# Altium project Comma Open 2024 MainBoard.PrjPcb
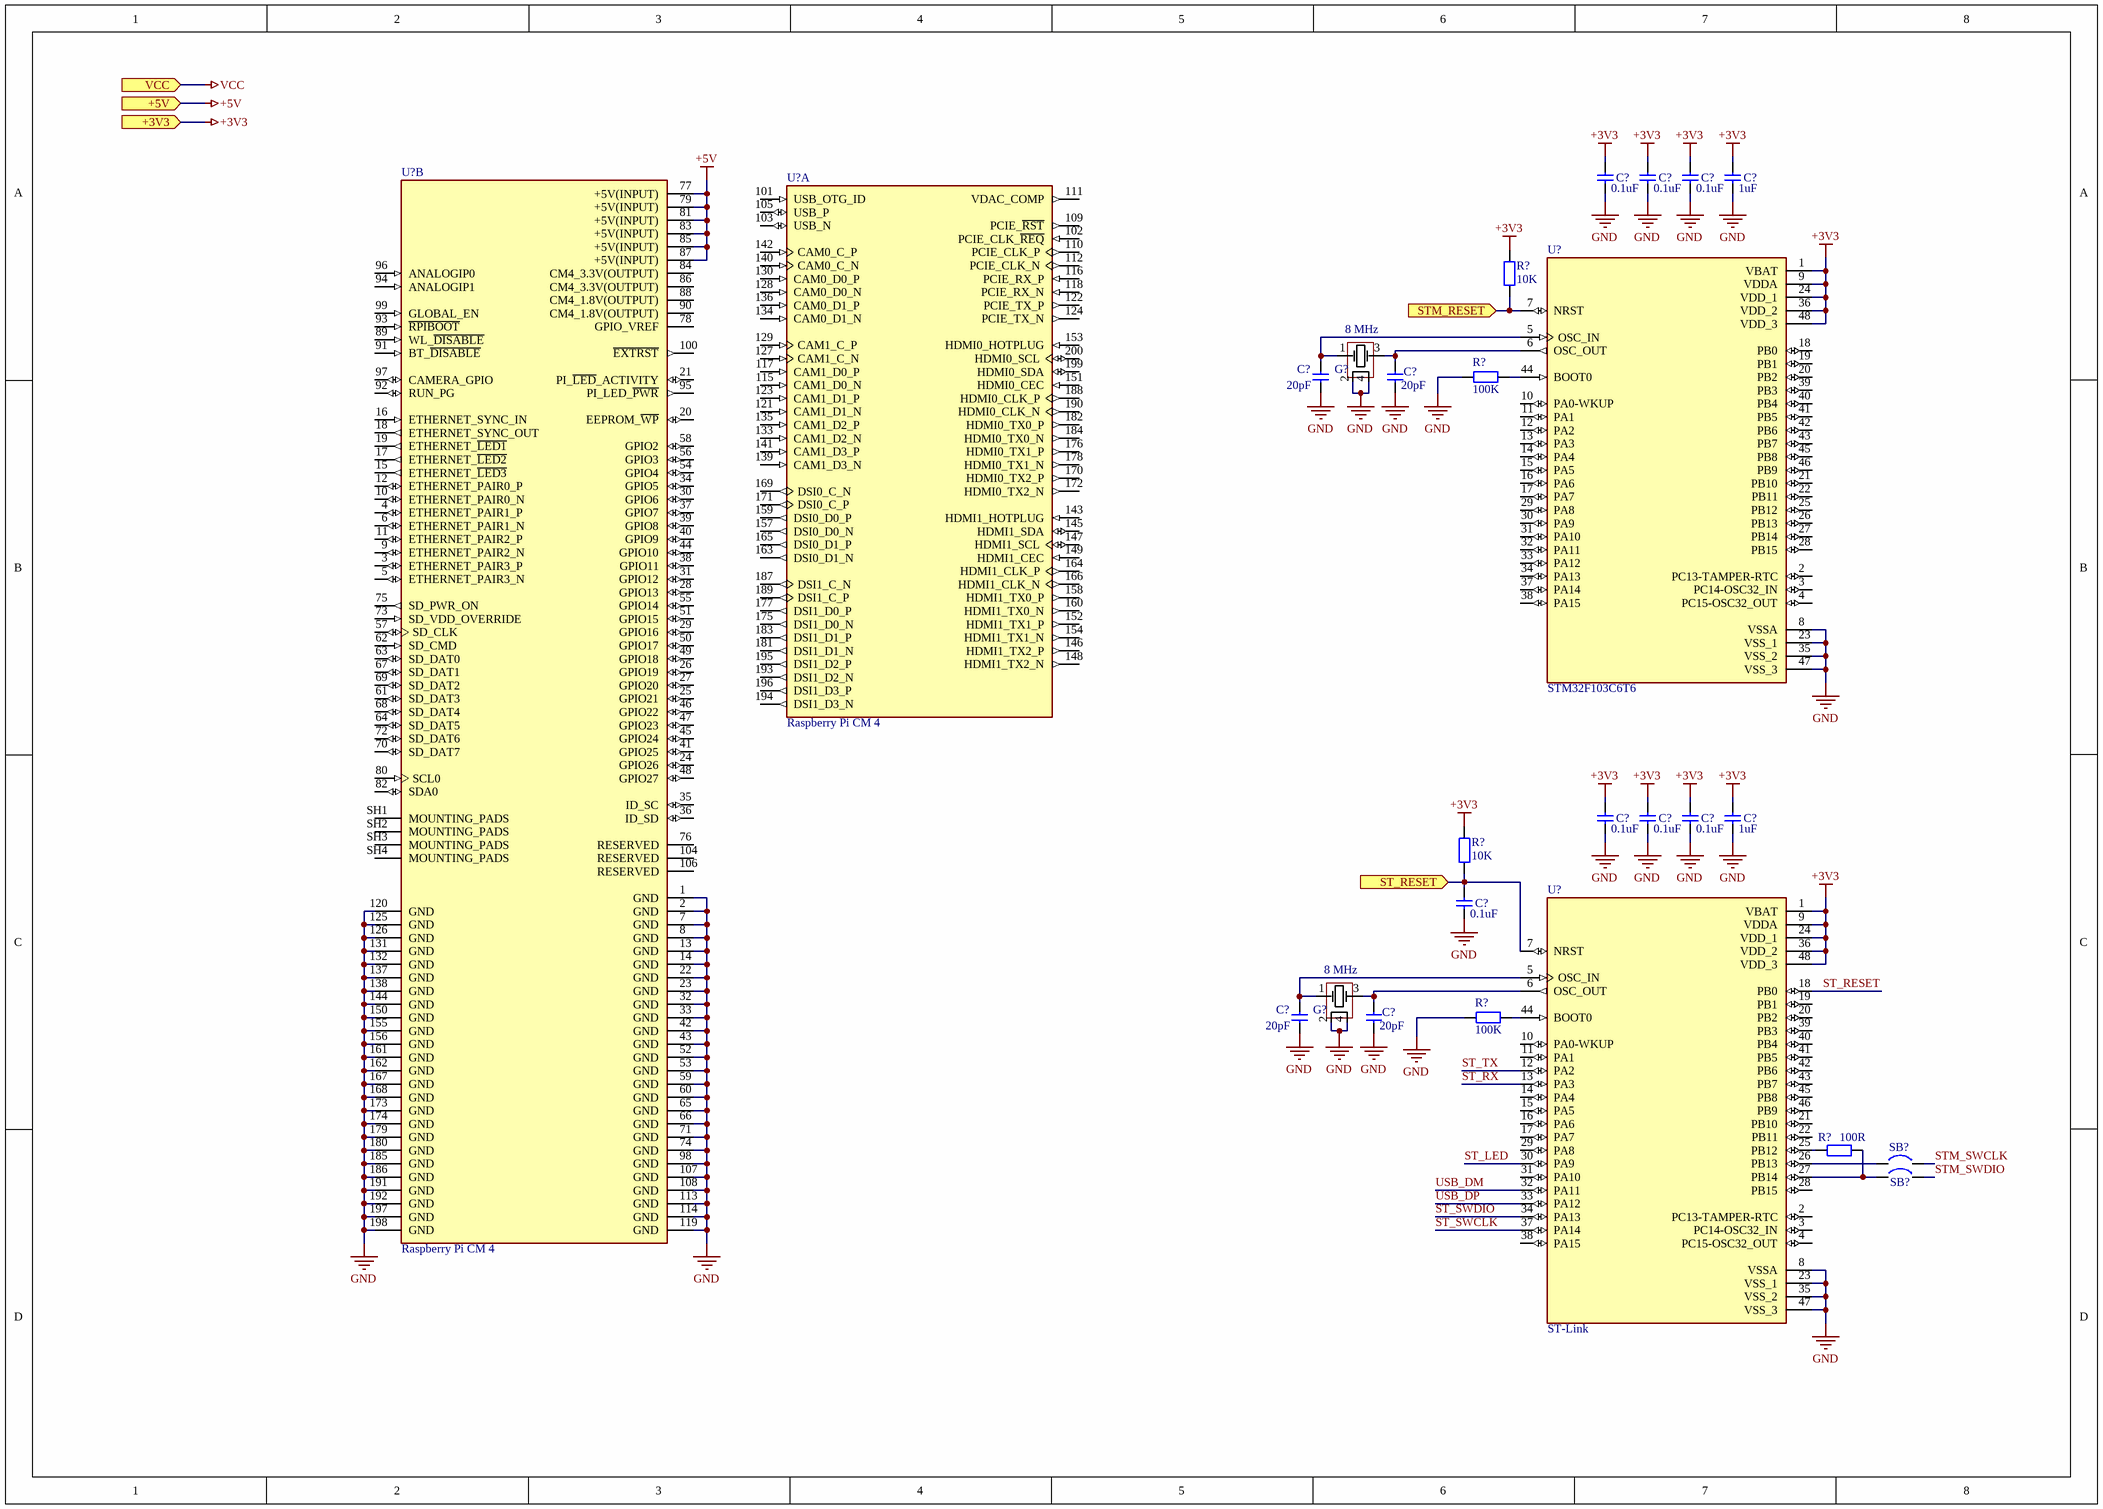
[diagram p0: MainBoard.SchDoc]
2 sheets, 39 parts. Net scope: flat (ports and power ports of the same name join across sheets).
Sheets:
  MainBoard.SchDoc
  Bluetooth.SchDoc

## Sheet MainBoard.SchDoc
size A3; SheetNumber: 1; SheetTotal: 1

### Parts
(Parts that share a designator on the sheet are numbered #1, #2 ... from top to bottom, then left to right.)
C?#1  0.1uF  [CAP0805]
C?#2  0.1uF  [CAP0805]
C?#3  0.1uF  [CAP0805]
C?#4  1uF  [CAP0805]
C?#5  20pF  [CAP0805]
C?#6  20pF  [CAP0805]
C?#7  0.1uF  [CAP0805]
C?#8  0.1uF  [CAP0805]
C?#9  0.1uF  [CAP0805]
C?#10  1uF  [CAP0805]
C?#11  0.1uF  [CAP0805]
C?#12  20pF  [CAP0805]
C?#13  20pF  [CAP0805]
G?#1  8 MHz
G?#2  8 MHz
R?#1  10K  [RES0805]
R?#2  100K  [RES0805]
R?#3  10K  [RES0805]
R?#4  100K  [RES0805]
R?#5  100R  [RES0805]
SB?#1  Solder Bridge  (value not drawn)
SB?#2  Solder Bridge  (value not drawn)
U?#1  Raspberry Pi CM 4  [Raspberry Pi CM 4]  (part A of 2)
U?#2  STM32F103C6T6  [LQFP-48]
U?#3  Raspberry Pi CM 4  [Raspberry Pi CM 4]  (part B of 2)
U?#4  ST-Link  [LQFP-48]

### Ports
+3V3 (in), +5V (in), ST_RESET (in), STM_RESET (in), VCC (in)

### Nets
+3V3: C?#1.2 C?#2.2 C?#3.2 C?#4.2 C?#7.2 C?#8.2 C?#9.2 C?#10.2 R?#1.2 R?#3.2 U?#2.1(VBAT) U?#2.9(VDDA) U?#2.24(VDD_1) U?#2.36(VDD_2) U?#2.48(VDD_3) U?#4.1(VBAT) U?#4.9(VDDA) U?#4.24(VDD_1) U?#4.36(VDD_2) U?#4.48(VDD_3) ; port +3V3
+5V: U?#3.77(+5V(INPUT)) U?#3.79(+5V(INPUT)) U?#3.81(+5V(INPUT)) U?#3.83(+5V(INPUT)) U?#3.85(+5V(INPUT)) U?#3.87(+5V(INPUT)) ; port +5V
GND: C?#1.1 C?#2.1 C?#3.1 C?#4.1 C?#5.1 C?#6.1 C?#7.1 C?#8.1 C?#9.1 C?#10.1 C?#11.1 C?#12.1 C?#13.1 G?#1.2 G?#1.4 G?#2.2 G?#2.4 R?#2.2 R?#4.2 U?#2.8(VSSA) U?#2.23(VSS_1) U?#2.35(VSS_2) U?#2.47(VSS_3) U?#3.1(GND) U?#3.2(GND) U?#3.7(GND) U?#3.8(GND) U?#3.13(GND) U?#3.14(GND) U?#3.22(GND) U?#3.23(GND) U?#3.32(GND) U?#3.33(GND) U?#3.42(GND) U?#3.43(GND) U?#3.52(GND) U?#3.53(GND) U?#3.59(GND) U?#3.60(GND) U?#3.65(GND) U?#3.66(GND) U?#3.71(GND) U?#3.74(GND) U?#3.98(GND) U?#3.107(GND) U?#3.108(GND) U?#3.113(GND) U?#3.114(GND) U?#3.119(GND) U?#3.120(GND) U?#3.125(GND) U?#3.126(GND) U?#3.131(GND) U?#3.132(GND) U?#3.137(GND) U?#3.138(GND) U?#3.144(GND) U?#3.150(GND) U?#3.155(GND) U?#3.156(GND) U?#3.161(GND) U?#3.162(GND) U?#3.167(GND) U?#3.168(GND) U?#3.173(GND) U?#3.174(GND) U?#3.179(GND) U?#3.180(GND) U?#3.185(GND) U?#3.186(GND) U?#3.191(GND) U?#3.192(GND) U?#3.197(GND) U?#3.198(GND) U?#4.8(VSSA) U?#4.23(VSS_1) U?#4.35(VSS_2) U?#4.47(VSS_3)
VCC: port VCC
ST_LED: U?#4.30(PA9)
ST_RESET: U?#4.18(PB0)
ST_RX: U?#4.13(PA3)
ST_SWCLK: U?#4.37(PA14)
ST_SWDIO: U?#4.34(PA13)
ST_TX: U?#4.12(PA2)
STM_SWCLK: SB?#1.2
STM_SWDIO: SB?#2.2
USB_DM: U?#4.32(PA11)
USB_DP: U?#4.33(PA12)
NetC?#5_2: C?#5.2 G?#1.1 U?#2.5(OSC_IN)
NetC?#6_2: C?#6.2 G?#1.3 U?#2.6(OSC_OUT)
NetC?#11_2: C?#11.2 R?#3.1 U?#4.7(NRST) ; port ST_RESET
NetC?#12_2: C?#12.2 G?#2.1 U?#4.5(OSC_IN)
NetC?#13_2: C?#13.2 G?#2.3 U?#4.6(OSC_OUT)
NetR?#1_1: R?#1.1 U?#2.7(NRST) ; port STM_RESET
NetR?#2_1: R?#2.1 U?#2.44(BOOT0)
NetR?#4_1: R?#4.1 U?#4.44(BOOT0)
NetR?#5_1: R?#5.1 U?#4.25(PB12)
NetR?#5_2: R?#5.2 SB?#2.1 U?#4.27(PB14)
NetSB?#1_1: SB?#1.1 U?#4.26(PB13)

Not connected (* = marked no-connect by the designer): U?#1 101(USB_OTG_ID) 102(PCIE_CLK_~{REQ}) 103(USB_N) 105(USB_P) 109(PCIE_~{RST}) 110(PCIE_CLK_P) 111(VDAC_COMP) 112(PCIE_CLK_N) 115(CAM1_D0_N) 116(PCIE_RX_P) 117(CAM1_D0_P) 118(PCIE_RX_N) 121(CAM1_D1_N) 122(PCIE_TX_P) 123(CAM1_D1_P) 124(PCIE_TX_N) 127(CAM1_C_N) 128(CAM0_D0_N) 129(CAM1_C_P) 130(CAM0_D0_P) 133(CAM1_D2_N) 134(CAM0_D1_N) 135(CAM1_D2_P) 136(CAM0_D1_P) 139(CAM1_D3_N) 140(CAM0_C_N) 141(CAM1_D3_P) 142(CAM0_C_P) 143(HDMI1_HOTPLUG) 145(HDMI1_SDA) 146(HDMI1_TX2_P) 147(HDMI1_SCL) 148(HDMI1_TX2_N) 149(HDMI1_CEC) 151(HDMI0_CEC) 152(HDMI1_TX1_P) 153(HDMI0_HOTPLUG) 154(HDMI1_TX1_N) 157(DSI0_D0_N) 158(HDMI1_TX0_P) 159(DSI0_D0_P) 160(HDMI1_TX0_N) 163(DSI0_D1_N) 164(HDMI1_CLK_P) 165(DSI0_D1_P) 166(HDMI1_CLK_N) 169(DSI0_C_N) 170(HDMI0_TX2_P) 171(DSI0_C_P) 172(HDMI0_TX2_N) 175(DSI1_D0_N) 176(HDMI0_TX1_P) 177(DSI1_D0_P) 178(HDMI0_TX1_N) 181(DSI1_D1_N) 182(HDMI0_TX0_P) 183(DSI1_D1_P) 184(HDMI0_TX0_N) 187(DSI1_C_N) 188(HDMI0_CLK_P) 189(DSI1_C_P) 190(HDMI0_CLK_N) 193(DSI1_D2_N) 194(DSI1_D3_N) 195(DSI1_D2_P) 196(DSI1_D3_P) 199(HDMI0_SDA) 200(HDMI0_SCL); U?#2 2(PC13-TAMPER-RTC) 3(PC14-OSC32_IN) 4(PC15-OSC32_OUT) 10(PA0-WKUP) 11(PA1) 12(PA2) 13(PA3) 14(PA4) 15(PA5) 16(PA6) 17(PA7) 18(PB0) 19(PB1) 20(PB2) 21(PB10) 22(PB11) 25(PB12) 26(PB13) 27(PB14) 28(PB15) 29(PA8) 30(PA9) 31(PA10) 32(PA11) 33(PA12) 34(PA13) 37(PA14) 38(PA15) 39(PB3) 40(PB4) 41(PB5) 42(PB6) 43(PB7) 45(PB8) 46(PB9); U?#3 3(ETHERNET_PAIR3_P) 4(ETHERNET_PAIR1_P) 5(ETHERNET_PAIR3_N) 6(ETHERNET_PAIR1_N) 9(ETHERNET_PAIR2_N) 10(ETHERNET_PAIR0_N) 11(ETHERNET_PAIR2_P) 12(ETHERNET_PAIR0_P) 15(ETHERNET_~{LED3}) 16(ETHERNET_SYNC_IN) 17(ETHERNET_~{LED2}) 18(ETHERNET_SYNC_OUT) 19(ETHERNET_~{LED1}) 20(EEPROM_~{WP}) 21(PI_~{LED}_ACTIVITY) 24(GPIO26) 25(GPIO21) 26(GPIO19) 27(GPIO20) 28(GPIO13) 29(GPIO16) 30(GPIO6) 31(GPIO12) 34(GPIO5) 35(ID_SC) 36(ID_SD) 37(GPIO7) 38(GPIO11) 39(GPIO8) 40(GPIO9) 41(GPIO25) 44(GPIO10) 45(GPIO24) 46(GPIO22) 47(GPIO23) 48(GPIO27) 49(GPIO18) 50(GPIO17) 51(GPIO15) 54(GPIO4) 55(GPIO14) 56(GPIO3) 57(SD_CLK) 58(GPIO2) 61(SD_DAT3) 62(SD_CMD) 63(SD_DAT0) 64(SD_DAT5) 67(SD_DAT1) 68(SD_DAT4) 69(SD_DAT2) 70(SD_DAT7) 72(SD_DAT6) 73(SD_VDD_OVERRIDE) 75(SD_PWR_ON) 76(RESERVED) 78(GPIO_VREF) 80(SCL0) 82(SDA0) 84(CM4_3.3V(OUTPUT)) 86(CM4_3.3V(OUTPUT)) 88(CM4_1.8V(OUTPUT)) 89(WL_~{DISABLE}) 90(CM4_1.8V(OUTPUT)) 91(BT_~{DISABLE}) 92(RUN_PG) 93(~{RPIBOOT}) 94(ANALOGIP1) 95(PI_LED_~{PWR}) 96(ANALOGIP0) 97(CAMERA_GPIO) 99(GLOBAL_EN) 100(~{EXTRST}) 104(RESERVED) 106(RESERVED) SH1(MOUNTING_PADS) SH2(MOUNTING_PADS) SH3(MOUNTING_PADS) SH4(MOUNTING_PADS); U?#4 2(PC13-TAMPER-RTC) 3(PC14-OSC32_IN) 4(PC15-OSC32_OUT) 10(PA0-WKUP) 11(PA1) 14(PA4) 15(PA5) 16(PA6) 17(PA7) 19(PB1) 20(PB2) 21(PB10) 22(PB11) 28(PB15) 29(PA8) 31(PA10) 38(PA15) 39(PB3) 40(PB4) 41(PB5) 42(PB6) 43(PB7) 45(PB8) 46(PB9)

### Library data of the parts
C?#1-C?#13 = CAP Ceramic: Ceramic SMD Cap
G?#1 G?#2 = Quartz
R?#1-R?#5 = RES: RES smd
U?#1 U?#3 = Raspberry Pi CM 4: Raspberry Pi compute module 4
U?#4 = STM32F103C6T6

## Sheet Bluetooth.SchDoc
size A4; SheetNumber: 2; SheetTotal: 2
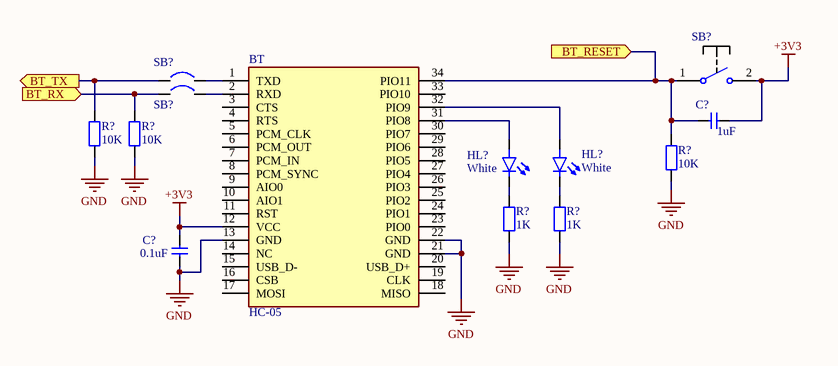
[diagram p1: Bluetooth.SchDoc]

### Parts
(Parts that share a designator on the sheet are numbered #1, #2 ... from top to bottom, then left to right.)
BT  HC-05  [HC-05]
C?#14  1uF  [CAP0805]
C?#15  0.1uF  [CAP0805]
HL?#1  White  [LED0805_WHITE]
HL?#2  White  [LED0805_WHITE]
R?#6  10K  [RES0805]
R?#7  10K  [RES0805]
R?#8  10K  [RES0805]
R?#9  1K  [RES0805]
R?#10  1K  [RES0805]
SB?#3  Solder Bridge  [Solder Bridge]  (value not drawn)
SB?#4  Button x2  [BUTTON_3x6]  (value not drawn)
SB?#5  Solder Bridge  [Solder Bridge]  (value not drawn)

### Ports
BT_RESET (in), BT_RX (in), BT_TX (out)

### Nets
+3V3: BT.12(VCC) C?#14.2 C?#15.2 SB?#4.2
GND: BT.13(GND) BT.21(GND) BT.22(GND) C?#15.1 R?#6.2 R?#7.2 R?#8.1 R?#9.1 R?#10.1
NetBT_1: BT.1(TXD) SB?#3.2
NetBT_2: BT.2(RXD) SB?#5.2
NetBT_31: BT.31(PIO8) HL?#1.2(A)
NetBT_32: BT.32(PIO9) HL?#2.2(A)
NetBT_34: BT.34(PIO11) C?#14.1 R?#8.2 SB?#4.1 ; port BT_RESET
NetHL?#1_1: HL?#1.1(K) R?#9.2
NetHL?#2_1: HL?#2.1(K) R?#10.2
NetR?#6_1: R?#6.1 SB?#3.1 ; port BT_TX
NetR?#7_1: R?#7.1 SB?#5.1 ; port BT_RX

Not connected (* = marked no-connect by the designer): BT 3(CTS) 4(RTS) 5(PCM_CLK) 6(PCM_OUT) 7(PCM_IN) 8(PCM_SYNC) 9(AIO0) 10(AIO1) 11(RST) 14(NC) 15(USB_D-) 16(CSB) 17(MOSI) 18(MISO) 19(CLK) 20(USB_D+) 23(PIO0) 24(PIO1) 25(PIO2) 26(PIO3) 27(PIO4) 28(PIO5) 29(PIO6) 30(PIO7) 33(PIO10)

### Library data of the parts
BT = HC-05: Bluetooth HC-05; ComponentLink1Description: Chipdip; ComponentLink1URL: https://www.chipdip.ru/product0/8020390968
C?#14 C?#15 = CAP Ceramic: Ceramic SMD Cap
HL?#1 HL?#2 = LED: LED smd
R?#6-R?#10 = RES: RES smd
SB?#4 = Button x2: 2 pad smd tact button

## Nets that join several sheets
+3V3: MainBoard (20 pins), Bluetooth (BT.12 C?#14.2 C?#15.2 SB?#4.2)
GND: MainBoard (78 pins), Bluetooth (9 pins)